# EAGLE design BQ51050B (EAGLE 7.5.0)
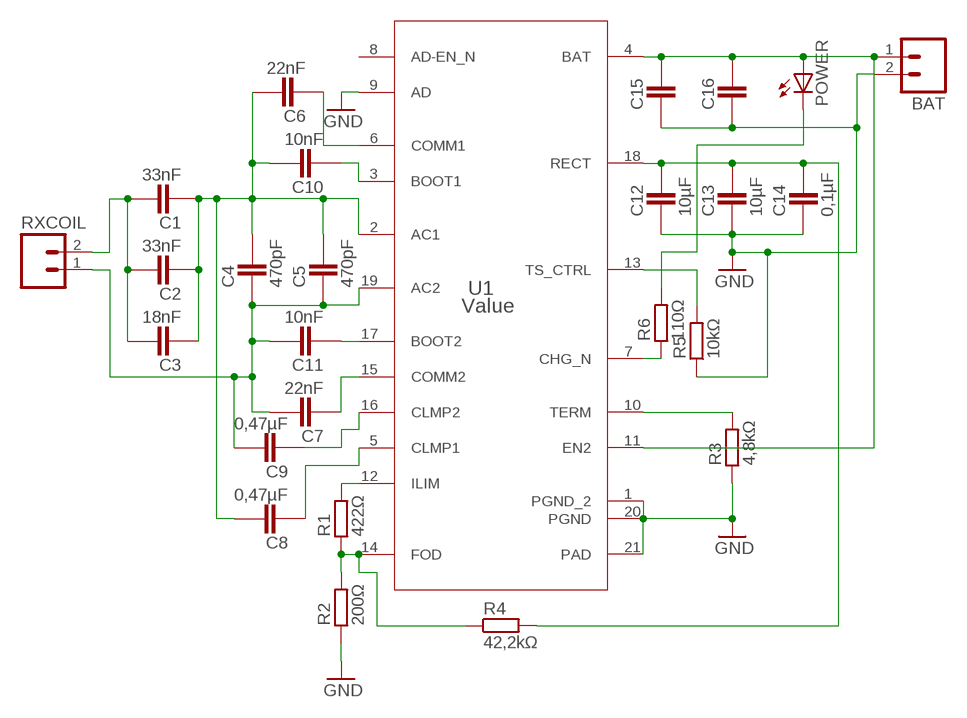
[diagram p0: schematic, sheet 1]

## Parts
BAT  M02LOCK  [1X02_LOCK]
C1  33nF  CAPACITOR_0402  [CAPC1005X60N]
C2  33nF  CAPACITOR_0402  [CAPC1005X60N]
C3  18nF  CAPACITOR_0402  [CAPC1005X60N]
C4  470pF  CAPACITOR_0402  [CAPC1005X60N]
C5  470pF  CAPACITOR_0402  [CAPC1005X60N]
C6  22nF  CAPACITOR_0402  [CAPC1005X60N]
C7  22nF  CAPACITOR_0402  [CAPC1005X60N]
C8  0,47µF  CAPACITOR_0402  [CAPC1005X60N]
C9  0,47µF  CAPACITOR_0402  [CAPC1005X60N]
C10  10nF  CAPACITOR_0402  [CAPC1005X60N]
C11  10nF  CAPACITOR_0402  [CAPC1005X60N]
C12  10µF  CAPACITOR_0603  [CAPC1608X92N]
C13  10µF  CAPACITOR_0603  [CAPC1608X92N]
C14  0,1µF  CAPACITOR_0402  [CAPC1005X60N]
C15  CAPACITOR_0402  [CAPC1005X60N]
C16  CAPACITOR_0402  [CAPC1005X60N]
POWER  LEDSML0603  [SML0603]
R1  422Ω  RESISTOR_0402  [RESC1005X40AN]
R2  200Ω  RESISTOR_0402  [RESC1005X40AN]
R3  4,8kΩ  RESISTOR_0402  [RESC1005X40AN]
R4  42,2kΩ  RESISTOR_0402  [RESC1005X40AN]
R5  10kΩ  RESISTOR_0402  [RESC1005X40AN]
R6  110Ω  RESISTOR_0402  [RESC1005X40AN]
RXCOIL  M02LOCK  [1X02_LOCK]
U1  Value  BQ51050BRHLR  [RHL0020A]

## Nets
GND: BAT.2 C12.1 C13.1 C14.1 C15.1 C16.1 R2.1 R3.1 R5.1 U1.1(PGND_2) U1.9(AD) U1.20(PGND) U1.21(PAD)
N$1: C1.2 C2.2 C3.2 RXCOIL.2
N$2: C12.2 C13.2 C14.2 R4.2 U1.18(RECT)
N$3: C1.1 C2.1 C3.1 C4.2 C5.2 C6.2 C8.2 C10.2 U1.2(AC1)
N$4: R1.2 U1.12(ILIM)
N$5: C4.1 C5.1 C7.2 C9.2 C11.2 RXCOIL.1 U1.19(AC2)
N$6: BAT.1 C15.2 C16.2 POWER.A U1.4(BAT) U1.11(EN2)
N$7: C6.1 U1.6(COMM1)
N$8: C7.1 U1.15(COMM2)
N$9: C8.1 U1.5(CLMP1)
N$10: C9.1 U1.16(CLMP2)
N$11: C10.1 U1.3(BOOT1)
N$12: C11.1 U1.17(BOOT2)
N$13: R1.1 R2.2 R4.1 U1.14(FOD)
N$14: R3.2 U1.10(TERM)
N$16: R5.2 U1.13(TS_CTRL)
N$17: POWER.C R6.2
N$18: R6.1 U1.7(CHG_N)
Unconnected: U1.8(AD-EN_N)

## Library data of the parts
BAT RXCOIL = SparkFun-Connectors:M02: Standard 2-pin 0.1" header. Use with - straight break away headers ( PRT-00116) - right angle break away headers (PRT-00553) - swiss pins (PRT-00743) - machine pins (PRT-00117) - female headers (PRT-00115) Molex polarized connector foot print use with: PRT-08233 with associated crimp pins and housings. 2.54_SCREWTERM for use with PRT-10571. 3.5mm Screw Terminal footprints for PRT-08084 5mm Screw Terminal footprints for use with PRT-08432
C1-C16 = ipc-7351-capacitor:CAPACITOR_
POWER = led:LED: LED OSRAM: - CHIPLED LG R971, LG N971, LY N971, LG Q971, LY Q971, LO R971, LY R971 LH N974, LH R974 LS Q976, LO Q976, LY Q976 LO Q996 - Hyper CHIPLED LW Q18S LB Q993, LB Q99A, LB R99A - SideLED LS A670, LO A670, LY A670, LG A670, LP A670 LB A673, LV A673, LT A673, LW A673 LH A674 LY A675 LS A676, LA A676, LO A676, LY A676, LW A676 LS A679, LY A679, LG A679 - Hyper Micro SIDELED® LS Y876, LA Y876, LO Y876, LY Y876 LT Y87S - SmartLED LW L88C, LW L88S LB L89C, LB L89S, LG L890 LS L89K, LO L89K, LY L89K LS L896, LA L896, LO L896, LY L896 - TOPLED LS T670, LO T670, LY T670, LG T670, LP T670 LSG T670, LSP T670, LSY T670, LOP T670, LYG T670 LG T671, LOG T671, LSG T671 LB T673, LV T673, LT T673, LW T673 LH T674 LS T676, LA T676, LO T676, LY T676, LB T676, LH T676, LSB T676, LW T676 LB T67C, LV T67C, LT T67C, LS T67K, LO T67K, LY T67K, LW E67C LS E67B, LA E67B, LO E67B, LY E67B, LB E67C, LV E67C, LT E67C LW T67C LS T679, LY T679, LG T679 LS T770, LO T770, LY T770, LG T770, LP T770 LB T773, LV T773, LT T773, LW T773 LH T774 LS E675, LA E675, LY E675, LS T675 LS T776, LA T776, LO T776, LY T776, LB T776 LHGB T686 LT T68C, LB T68C - Hyper Mini TOPLED® LB M676 - Mini TOPLED Santana® LG M470 LS M47K, LO M47K, LY M47K Source: http://www.osram.convergy.de LUXEON: - LUMILED® LXK2-PW12-R00, LXK2-PW12-S00, LXK2-PW14-U00, LXK2-PW14-V00 LXK2-PM12-R00, LXK2-PM12-S00, LXK2-PM14-U00 LXK2-PE12-Q00, LXK2-PE12-R00, LXK2-PE12-S00, LXK2-PE14-T00, LXK2-PE14-U00 LXK2-PB12-K00, LXK2-PB12-L00, LXK2-PB12-M00, LXK2-PB14-N00, LXK2-PB14-P00, LXK2-PB14-Q00 LXK2-PR12-L00, LXK2-PR12-M00, LXK2-PR14-Q00, LXK2-PR14-R00 LXK2-PD12-Q00, LXK2-PD12-R00, LXK2-PD12-S00 LXK2-PH12-R00, LXK2-PH12-S00 LXK2-PL12-P00, LXK2-PL12-Q00, LXK2-PL12-R00 Source: www.luxeon.com KINGBRIGHT: KA-3528ASYC Source: www.kingbright.com
R1-R6 = ipc-7351-resistor:RESISTOR_
U1 = BQ51050:BQ51050BRHLR; COMPTYPE: IC; MANUFACTURER: Texas Instruments; MOUNTTYPE: SMT; PACKAGEREFERENCE: RHL0020A; PARTNUMBER: BQ51050BRHLR; PIN_COUNT: 21; REFDES: RefDes; ROHS: Y; TYPE: TYPE

## Board
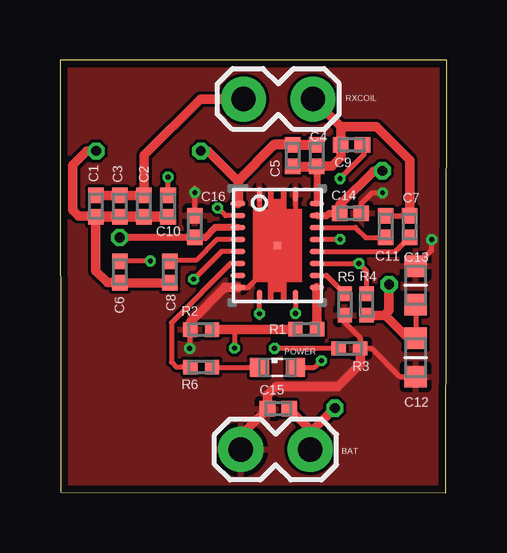
[diagram p1: board, top side]
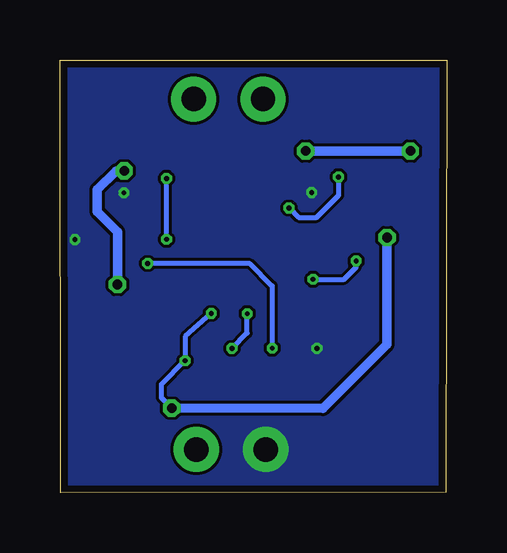
[diagram p2: board, bottom side, seen from below]

Size 16.13 x 18.06 mm. Coordinates in mm from the lower left corner, seen from the top.
Outline: 0.03,0.04 16.09,0 16.13,18.05 0,18.06 0.03,0.04
Copper layers (1*16): Top 0.035mm / dielectric 1.5mm / Bottom 0.035mm
Design rules "PCB-POOL HighSpec": minimum track width 0.125mm, minimum drill 0.2mm, track to track 0.125mm, track to pad 0.125mm, pad to pad 0.125mm, via to via 0.125mm, smd to smd 0.125mm, copper to edge 0.3mm, drill to drill 0.2mm, minimum pad ring 0.2mm, minimum via ring 0.125mm, stop-mask expansion 0.075mm, vias tented up to drill 0mil, thermal gap 0.2mm

### Footprints (pad centres in the part's own frame; a part is rotated, then mirrored left to right if it is on the bottom)
1X02_LOCK = drill 1.016 pad 1.88: 1 -0.178,0; 2 2.718,0
CAPC1005X60N = smd 0.65 x 0.65: 1 -0.45,0; 2 0.45,0
CAPC1608X92N = smd 0.9 x 0.95: 1 -0.8,0; 2 0.8,0
SML0603 = smd 0.8 x 0.8: A 0.75,0; C -0.75,0
RESC1005X40AN = smd 0.6 x 0.6: 1 -0.45,0; 2 0.45,0
RHL0020A = smd 0.229 x 0.61: 1 -0.75,2.15; 10 -0.75,-2.15; 11 0.75,-2.15; 20 0.75,2.15 | smd 0.61 x 0.229: 2 -1.65,1.75; 3 -1.65,1.25; 4 -1.65,0.75; 5 -1.65,0.25; 6 -1.65,-0.25; 7 -1.65,-0.75; 8 -1.65,-1.25; 9 -1.65,-1.75; 12 1.65,-1.75; 13 1.65,-1.25; 14 1.65,-0.75; 15 1.65,-0.25; 16 1.65,0.25; 17 1.65,0.75; 18 1.65,1.25; 19 1.65,1.75 | smd 0.305 x 0.305: 21 0,0

### Placement (x,y rotation side)
BAT  10.26,1.82 180 top
C1  1.5,11.96 90 top
C2  3.51,11.96 90 top
C3  2.5,11.96 90 top
C4  10.71,14.07 90 top
C5  9.7,14.07 90 top
C6  2.5,9.22 270 top
C7  14.58,11.11 90 top
C8  4.58,9.22 270 top
C9  12.17,14.52 180 top
C10  4.51,11.96 270 top
C11  13.58,11.11 90 top
C12  14.83,5.65 90 top
C13  14.83,8.66 270 top
C14  12.12,11.67 180 top
C15  9.11,3.52 0 top
C16  5.63,11.11 270 top
POWER  9.07,5.25 0 top
R1  10.27,6.83 0 top
R2  5.89,6.82 0 top
R3  12.08,6.03 180 top
R4  12.79,7.86 270 top
R5  11.89,7.86 90 top
R6  5.89,5.26 0 top
RXCOIL  10.38,16.43 180 top
U1  9.07,10.33 0 top

### Tracks (layer width: path | path; a pad name or v marks a point on that pad's centre or on a via)
GND  (via drill 0.2)
  Top 0.2: U1.1 8.32,11.62 | 8.32,11.62 8.32,11.04 9.03,10.33 U1.21 | U1.20 9.82,10.81 9.33,10.33 U1.21 | U1.9 7.85,8.58 8.89,9.61 8.89,10.15 U1.21 | 8.79,11.68 8.85,11.62 8.32,11.62 | C16.1 v5.63,12.54 5.63,12.7 | C13.1 15.51,10.13 v15.51,10.57 | R2.1 5.41,6.79 v5.41,6.03 | C14.1 12.58,12.07 13.03,12.52 v13.46,12.52 | C12.1 14.19,4.85 13,6.03 R3.1 12.53,6.47 11.89,7.11
  Top 0.4: R2.1 5.44,7.15 6.87,8.58 U1.9 | BAT.2 7.54,2.41 C15.1 8.66,4.09 9.02,4.45 11.6,4.45 12.54,5.39 12.54,6.03 R3.1
  pour Bottom (no thermals): 0.14,0.1 16.01,0.1 16.01,17.95 0.14,17.95
  pour Top: 0.14,0.1 16.01,0.1 16.01,17.95 0.14,17.95
N$1
  Top 0.4: C1.2 C3.2 C2.2 3.51,14.08 5.85,16.43 RXCOIL.2
N$2  (via drill 0.4)
  Top 0.2: 11.67,11.58 C14.2 | R4.2 13.58,7.41 | 14.54,6.45 C12.2 C13.2
  Top 0.3: U1.18 10.73,11.58 11.15,11.58 11.24,11.67 C14.2
  Top 0.4: 13.58,7.41 14.54,6.45 | R4.2 13.52,7.41 13.73,7.62 v13.73,8.7 | C14.2 11.68,12.02 13.09,13.44 v13.45,13.44
  Bottom 0.4: v13.73,8.7 13.73,10.88 14.58,11.74 14.58,12.65 13.79,13.44 v13.45,13.44
N$3  (via drill 0.4)
  Top 0.2: 3.02,8.76 C6.2 | 4.48,11.54 C10.2 C1.1
  Top 0.4: C1.1 C3.1 C2.1 C10.2 | C6.2 C8.2 | 4.48,11.54 0.79,11.54 0.53,11.8 0.53,13.68 1.12,14.26 v1.51,14.26 | v5.88,14.26 6.17,14.26 7.42,13.02 | C1.1 1.5,9.26 1.98,8.78 C6.2
  Top 0.406: C4.2 C5.2 8.92,14.52 7.42,13.02 U1.2
  Bottom 0.4: v5.88,14.26 v1.51,14.26
N$4
  Top 0.4: R1.2 U1.12
N$5
  Top 0.2: C4.1 10.72,13.61 | 10.71,13.61 C4.1 | C7.2 C11.2 14.54,11.56 14.54,11.57 C7.2 | 11.72,15.28 11.72,15.27
  Top 0.3: 10.72,13.61 U1.19
  Top 0.4: RXCOIL.1 11.72,15.27 C9.2 11.72,14 11.34,13.63 C4.1 | C7.2 14.59,13.89 13.21,15.28 11.72,15.28
  Top 0.406: C5.1 C4.1
N$6  (via drill 0.2, 0.4)
  Top 0.2: C16.2 6.07,10.66 6.06,10.66 | U1.4 | U1.11 v9.82,7.49 | POWER.A 10.63,5.25 v10.91,5.52 | 9.59,3.55 C15.2 | 10.44,2.63 10.56,2.63
  Top 0.3: 6.07,10.66 6.48,11.07 U1.4 | 6.06,10.66 v2.49,10.66
  Top 0.4: C15.2 10.44,2.63 BAT.1 | 10.56,2.63 v11.47,3.54
  Bottom 0.2: v11.47,3.54 11.9,3.98 11.9,4.53 v10.91,5.52 10.91,6.53 v9.82,7.49
  Bottom 0.4: v11.47,3.54 5.16,3.53 2.49,6.2 v2.49,10.66
N$7  (via drill 0.2)
  Top 0.2: U1.6 6.74,10.08 v5.58,8.92 | v3.77,9.68 2.51,9.68 C6.1
  Bottom 0.2: v5.58,8.92 4.28,8.92 3.77,9.42 v3.77,9.68
N$8
  Top 0.2: U1.15 13.99,10.08 C7.1
N$9
  Top 0.2: U1.5 7.3,10.57 6.54,10.57 5.68,9.7 4.59,9.7 C8.1
N$10  (via drill 0.2)
  Top 0.2: v11.68,10.58 U1.16 | C9.1 12.69,14.45 12.69,14.12 v11.68,13.12
  Bottom 0.2: v11.68,10.58 v11.68,13.12
N$11  (via drill 0.2)
  Top 0.2: C10.1 v4.51,13.18 | U1.3 6.9,11.57 v6.58,11.89
  Bottom 0.2: v4.51,13.18 C10.1 5.43,11.49 6.17,11.49 6.57,11.89 v6.58,11.89
N$12
  Top 0.2: U1.17 12.33,11.08 12.75,10.66 13.57,10.66 C11.1
N$13  (via drill 0.2)
  Top 0.2: U1.14 v12.47,9.58 12.79,9.26 R4.1 | R1.1 9.81,6.85 7.28,6.85 v7.28,6.05
  Top 0.4: R2.2 6.36,6.83 R1.1
  Bottom 0.2: v7.28,6.05 7.28,8.64 8.2,9.56 | 8.2,9.56 | 8.2,9.56 12.46,9.56 v12.47,9.58
N$14  (via drill 0.2)
  Top 0.2: R3.2 v8.95,6.03 | v8.32,7.48 8.32,7.3 U1.10
  Bottom 0.2: v8.95,6.03 8.32,6.67 v8.32,7.48
N$16
  Top 0.2: U1.13 11.12,9.08 R5.2
N$17
  Top 0.2: R6.2 6.36,5.25 POWER.C
N$18
  Top 0.2: 5.03,5.26 R6.1 4.85,5.26 4.65,5.46 4.65,7.1 7.12,9.58 U1.7